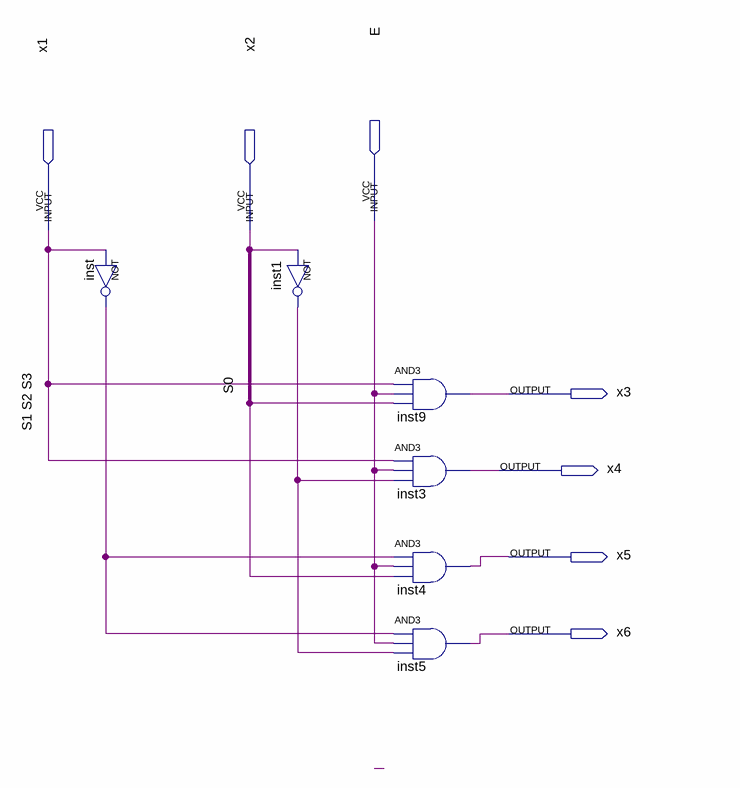
[diagram p0: schematic sheet]
// Quartus schematic Decoder2para4.bdf as structural Verilog: 6 symbols, 7 pins
module Decoder2para4 (
  input  E,
  input  x1,
  input  x2,
  output x3,
  output x4,
  output x5,
  output x6
);

  wire inst1_out, inst_out, S0;

  not inst (inst_out, x1);
  not inst1 (inst1_out, x2);
  and inst9 (x3, x1, E, S0);
  and inst3 (x4, x1, E, inst1_out);
  and inst4 (x5, inst_out, E, S0);
  and inst5 (x6, inst_out, E, inst1_out);

  // Other names for the same wires on the sheet: S1 S2 S3 = x1
endmodule
